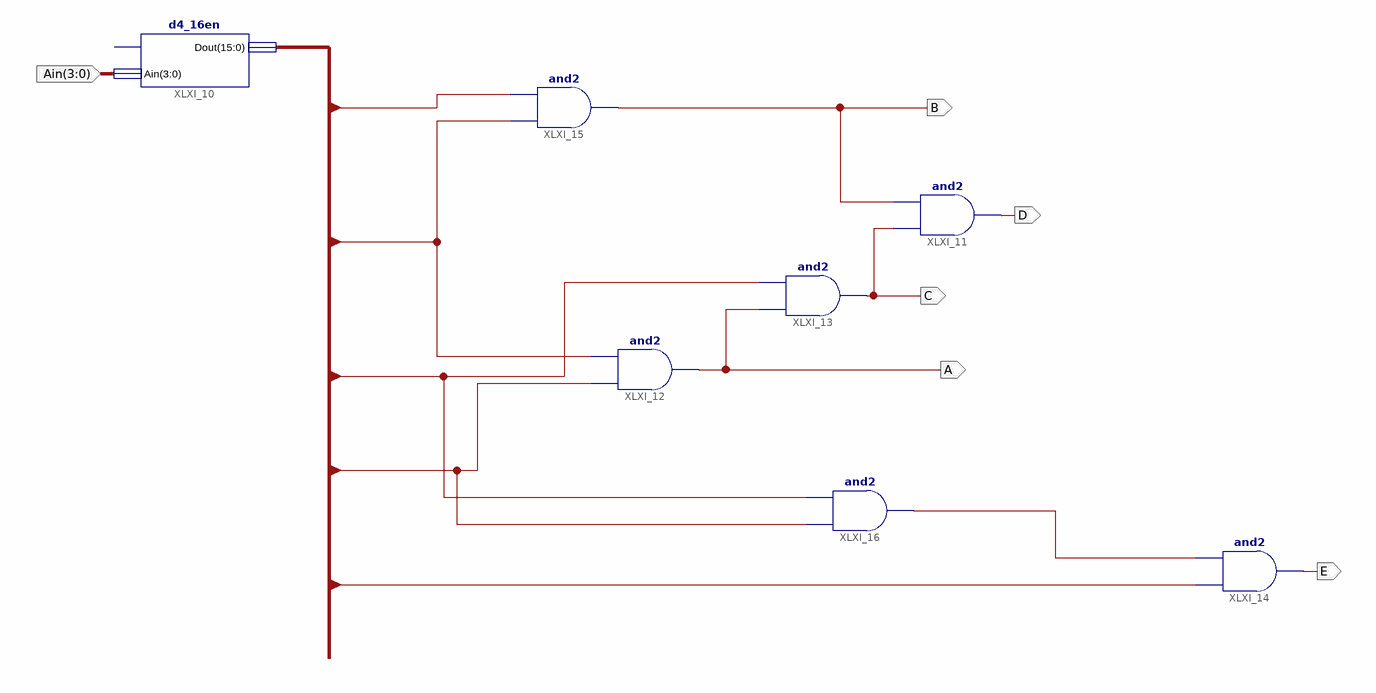
[diagram p0: schematic sheet 1]
// Xilinx ISE schematic decoder.sch (spartan3e) as structural Verilog: 7 symbols, 6 ports
module decoder (
  input  [3:0] Ain,
  output B,
  output A,
  output C,
  output D,
  output E
);

  wire XLXN_55;
  wire [15:0] Dout;

  d4_16en XLXI_10 (.Ain(Ain), .Dout(Dout));  // open: En
  and XLXI_11 (D, C, B);
  and XLXI_12 (A, Dout[8], Dout[4]);
  and XLXI_13 (C, A, Dout[6]);
  and XLXI_14 (E, Dout[12], XLXN_55);
  and XLXI_15 (B, Dout[4], Dout[2]);
  and XLXI_16 (XLXN_55, Dout[8], Dout[6]);
endmodule
